# EAGLE schematic OBCv5.0 (EAGLE 9.6.2)

## Sheet 1 of 3
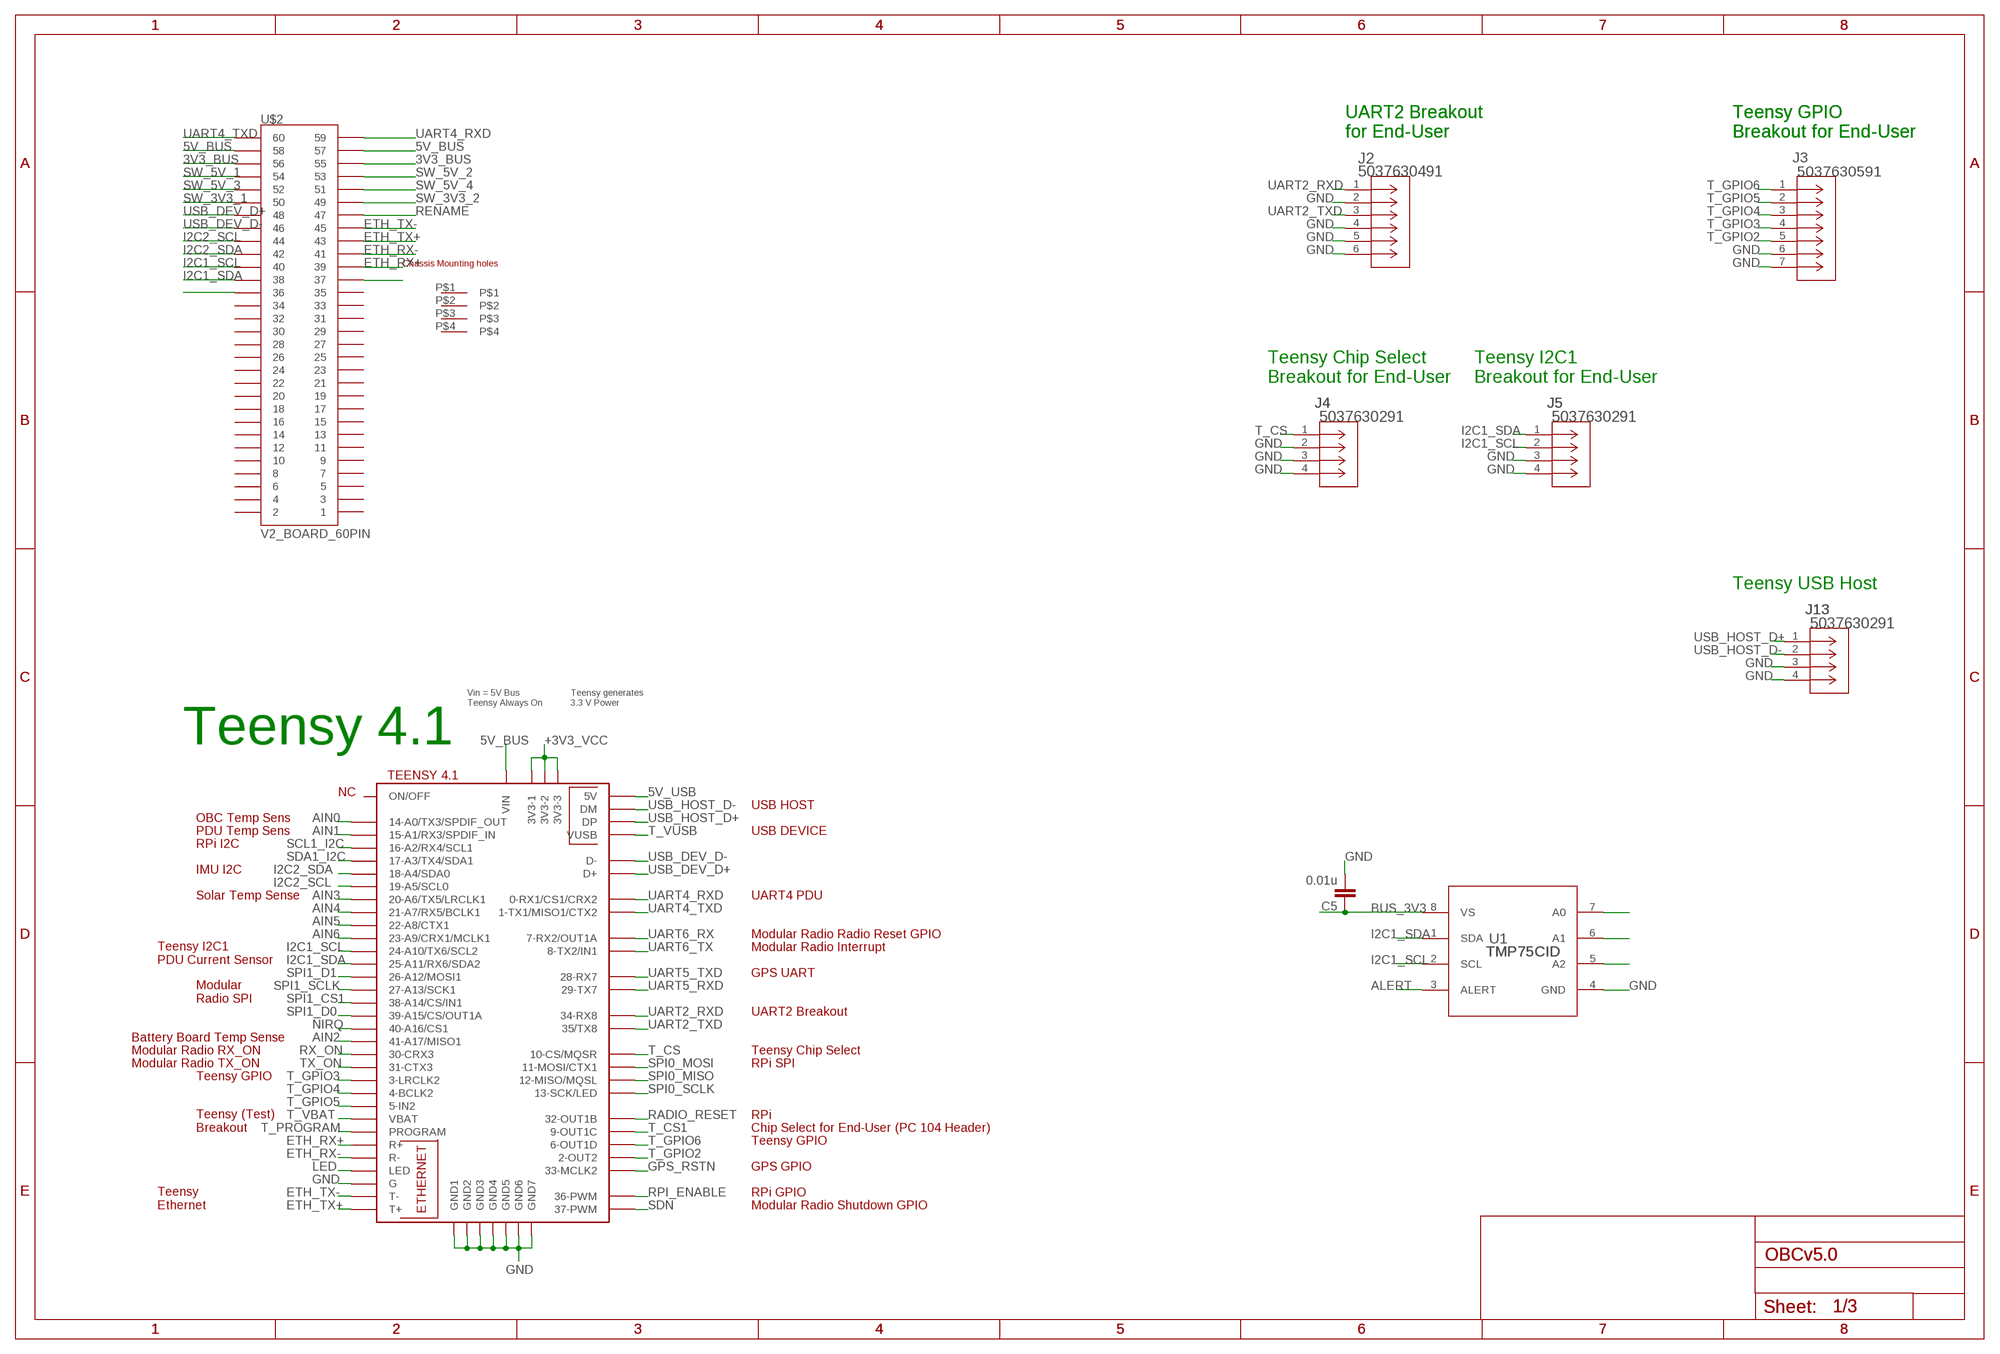
[diagram p0: schematic, sheet 1]

### Parts
C5  0.01u  CAP0805  [0805]
J2  5037630491  [CON_5037630491]
J3  5037630591  [CON_5037630591]
J4  5037630291  [CON_5037630291]
J5  5037630291  [CON_5037630291]
J13  5037630291  [CON_5037630291]
U1  TMP75CID  [D0008A_N]
U$1  TEENSY41TEENSY  [TEENSY41]
U$2  V2_BOARD_60PIN  [PC104_WCONN_BACKPLANE_HEADER]

### Nets
3V3_BUS: U$2.55 U$2.56
5V_BUS: U$1.VIN U$2.57 U$2.58 ; also sheet 2
5V_USB: U$1.+5V(5V)
+3V3_VCC: U$1.3V3-1 U$1.3V3-2 U$1.3V3-3 ; also sheet 3
AIN0: U$1.14-A0/TX3/SPDIF_OUT
AIN1: U$1.15-A1/RX3/SPDIF_IN
AIN2: U$1.41-A17/MISO1
AIN3: U$1.20-A6/TX5/LRCLK1
AIN4: U$1.21-A7/RX5/BCLK1
AIN5: U$1.22-A8/CTX1
AIN6: U$1.23-A9/CRX1/MCLK1
ALERT: U1.3(ALERT)
BUS_3V3: C5.1 U1.8(VS)
ETH_RX+: U$1.R+ U$2.39
ETH_RX-: U$1.R- U$2.41
ETH_TX+: U$1.T+ U$2.43
ETH_TX-: U$1.T- U$2.45
GND: C5.2 J2.2 J2.4 J2.5 J2.6 J3.6 J3.7 J4.2 J4.3 J4.4 J5.3 J5.4 J13.3 J13.4 U1.4(GND) U$1.G U$1.GND1 U$1.GND2 U$1.GND3 U$1.GND4 U$1.GND5 U$1.GND6 U$1.GND(GND7) ; also sheet 2,3
GPS_RSTN: U$1.33-MCLK2
I2C1_SCL: J5.2 U1.2(SCL) U$1.24-A10/TX6/SCL2 U$2.40
I2C1_SDA: J5.1 U1.1(SDA) U$1.25-A11/RX6/SDA2 U$2.38
I2C2_SCL: U$1.19-A5/SCL0 U$2.44 ; also sheet 3
I2C2_SDA: U$1.18-A4/SDA0 U$2.42 ; also sheet 3
LED: U$1.LED
N$11: U$2.37
N$12: U1.5(A2)
N$13: U1.6(A1)
N$15: U1.7(A0)
N$24: U$2.36
NIRQ: U$1.40-A16/CS1 ; also sheet 3
RADIO_RESET: U$1.32-OUT1B ; also sheet 3
RENAME: U$2.47
RPI_ENABLE: U$1.36-PWM ; also sheet 2
RX_ON: U$1.30-CRX3 ; also sheet 3
SCL1_I2C: U$1.16-A2/RX4/SCL1 ; also sheet 2
SDA1_I2C: U$1.17-A3/TX4/SDA1 ; also sheet 2
SDN: U$1.37-PWM ; also sheet 3
SPI0_MISO: U$1.12-MISO/MQSL ; also sheet 2
SPI0_MOSI: U$1.11-MOSI/CTX1 ; also sheet 2
SPI0_SCLK: U$1.13-SCK/LED ; also sheet 2
SPI1_CS1: U$1.38-A14/CS/IN1 ; also sheet 3
SPI1_D0: U$1.39-A15/CS/OUT1A ; also sheet 3
SPI1_D1: U$1.26-A12/MOSI1 ; also sheet 3
SPI1_SCLK: U$1.27-A13/SCK1 ; also sheet 3
SW_3V3_1: U$2.50
SW_3V3_2: U$2.49 ; also sheet 3
SW_5V_1: U$2.54
SW_5V_2: U$2.53
SW_5V_3: U$2.52
SW_5V_4: U$2.51
T_CS: J4.1 U$1.10-CS\MQSR(10-CS/MQSR)
T_CS1: U$1.9-OUT1C
T_GPIO2: J3.5 U$1.2-OUT2
T_GPIO3: J3.4 U$1.3-LRCLK2
T_GPIO4: J3.3 U$1.4-BCLK2
T_GPIO5: J3.2 U$1.5-IN2
T_GPIO6: J3.1 U$1.6-OUT1D
T_PROGRAM: U$1.PROGRAM
T_VBAT: U$1.VBAT
T_VUSB: U$1.VUSB
TX_ON: U$1.31-CTX3 ; also sheet 3
UART2_RXD: J2.1 U$1.34-RX8
UART2_TXD: J2.3 U$1.35-TX8(35/TX8)
UART4_RXD: U$1.0-RX1/CS1/CRX2 U$2.59
UART4_TXD: U$1.1-TX1/MISO1/CTX2 U$2.60
UART5_RXD: U$1.29-TX7
UART5_TXD: U$1.28-RX7
UART6_RX: U$1.7-RX2/OUT1A ; also sheet 2
UART6_TX: U$1.8-TX2/IN1 ; also sheet 2
USB_DEV_D+: U$1.D+ U$2.48
USB_DEV_D-: U$1.D- U$2.46
USB_HOST_D+: J13.1 U$1.DP
USB_HOST_D-: J13.2 U$1.DM
Unconnected: U$1.ON/OFF U$2.1 U$2.2 U$2.3 U$2.4 U$2.5 U$2.6 U$2.7 U$2.8 U$2.9 U$2.10 U$2.11 U$2.12 U$2.13 U$2.14 U$2.15 U$2.16 U$2.17 U$2.18 U$2.19 U$2.20 U$2.21 U$2.22 U$2.23 U$2.24 U$2.25 U$2.26 U$2.27 U$2.28 U$2.29 U$2.30 U$2.31 U$2.32 U$2.33 U$2.34 U$2.35 U$2.P$1 U$2.P$2 U$2.P$3 U$2.P$4

### Notes on the sheet
- UART2 Breakout
  for End-User
- UART2 Breakout
  for End-User
- Teensy GPIO
  Breakout for End-User
- Teensy GPIO
  Breakout for End-User
- Teensy Chip Select
  Breakout for End-User
- Teensy I2C1 
  Breakout for End-User
- Teensy USB Host
- Vin = 5V Bus 
  Teensy Always On
- Teensy generates 
  3.3 V Power
- Teensy 4.1
- NC
- USB HOST
- OBC Temp Sens
- PDU Temp Sens | USB DEVICE
- RPi I2C
- IMU I2C
- Solar Temp Sense | UART4 PDU
- Modular Radio Radio Reset GPIO
- Modular Radio Interrupt
- Teensy I2C1
  PDU Current Sensor
- GPS UART
- Modular 
  Radio SPI
- UART2 Breakout
- Battery Board Temp Sense
- Modular Radio RX_ON | Teensy Chip Select
- Modular Radio TX_ON | RPi SPI
- Teensy GPIO
- RPi
- Teensy (Test)
  Breakout
- Chip Select for End-User (PC 104 Header)
- Teensy GPIO
- GPS GPIO
- RPi GPIO
- Teensy 
  Ethernet
- Modular Radio Shutdown GPIO

## Sheet 2 of 3
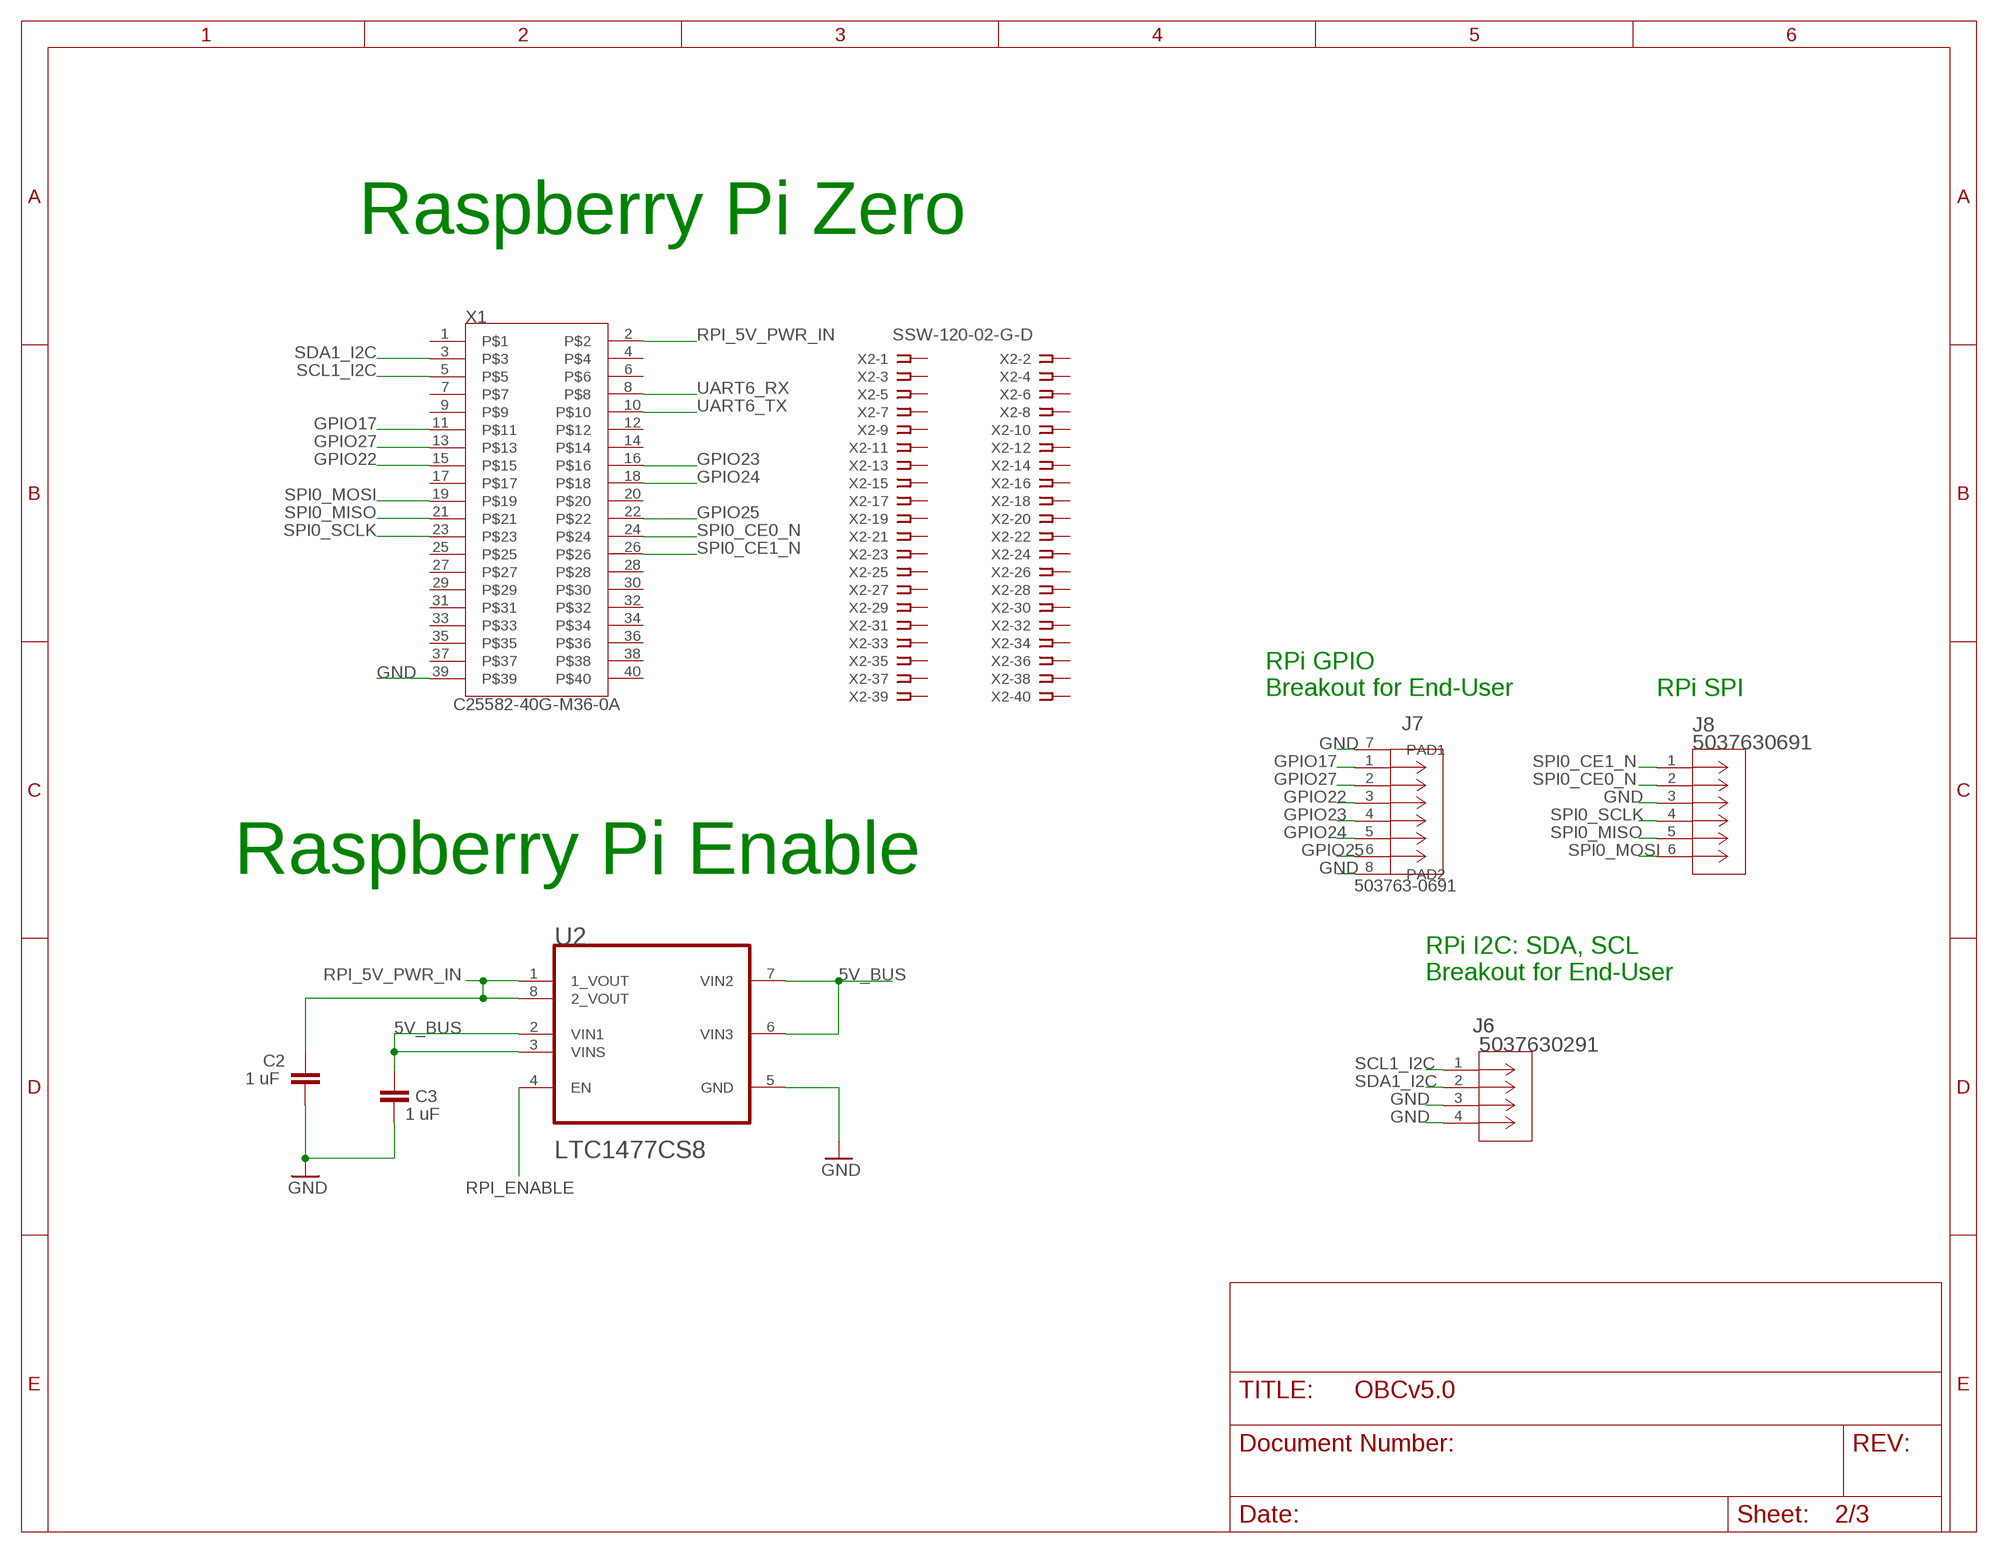
[diagram p1: schematic, sheet 2]

### Parts
C2  1 uF  CAP0805  [0805]
C3  1 uF  CAP0805  [0805]
J6  5037630291  [CON_5037630291]
J7  503763-0691  [CONN_503763-0691_MOL]
J8  5037630691  [CONN_503763-0691_MOL]
U2  LTC1477CS8LINEAR_TECHNOLOGY_LTC1477CS8_0_2  [LINEAR_TECHNOLOGY_LTC1477CS8_2]
X1  C25582-40G-M36-0A  [ADAFRUIT_C25582-40G-M36-0A_0]
X2  SSW-120-02-G-D  [SSW-120-02-G-D]

### Nets
5V_BUS: C3.1 U2.2(VIN1) U2.3(VINS) U2.6(VIN3) U2.7(VIN2) ; also sheet 1
GND: C2.2 C3.2 J6.3 J6.4 J7.7(PAD1) J7.8(PAD2) J8.3 U2.5(GND) X1.39 ; also sheet 1,3
GPIO17: J7.1 X1.11
GPIO22: J7.3 X1.15
GPIO23: J7.4 X1.16
GPIO24: J7.5 X1.18
GPIO25: J7.6 X1.22
GPIO27: J7.2 X1.13
RPI_5V_PWR_IN: C2.1 U2.1(1_VOUT) U2.8(2_VOUT) X1.2
RPI_ENABLE: U2.4(EN) ; also sheet 1
SCL1_I2C: J6.1 X1.5 ; also sheet 1
SDA1_I2C: J6.2 X1.3 ; also sheet 1
SPI0_CE0_N: J8.2 X1.24
SPI0_CE1_N: J8.1 X1.26
SPI0_MISO: J8.5 X1.21 ; also sheet 1
SPI0_MOSI: J8.6 X1.19 ; also sheet 1
SPI0_SCLK: J8.4 X1.23 ; also sheet 1
UART6_RX: X1.8 ; also sheet 1
UART6_TX: X1.10 ; also sheet 1
Unconnected: X1.1 X1.4 X1.6 X1.7 X1.9 X1.12 X1.14 X1.17 X1.20 X1.25 X1.27 X1.28 X1.29 X1.30 X1.31 X1.32 X1.33 X1.34 X1.35 X1.36 X1.37 X1.38 X1.40 X2.1 X2.2 X2.3 X2.4 X2.5 X2.6 X2.7 X2.8 X2.9 X2.10 X2.11 X2.12 X2.13 X2.14 X2.15 X2.16 X2.17 X2.18 X2.19 X2.20 X2.21 X2.22 X2.23 X2.24 X2.25 X2.26 X2.27 X2.28 X2.29 X2.30 X2.31 X2.32 X2.33 X2.34 X2.35 X2.36 X2.37 X2.38 X2.39 X2.40

### Notes on the sheet
- Raspberry Pi Zero
- RPi GPIO
  Breakout for End-User
- RPi SPI
- Raspberry Pi Enable
- RPi I2C: SDA, SCL 
  Breakout for End-User

## Sheet 3 of 3
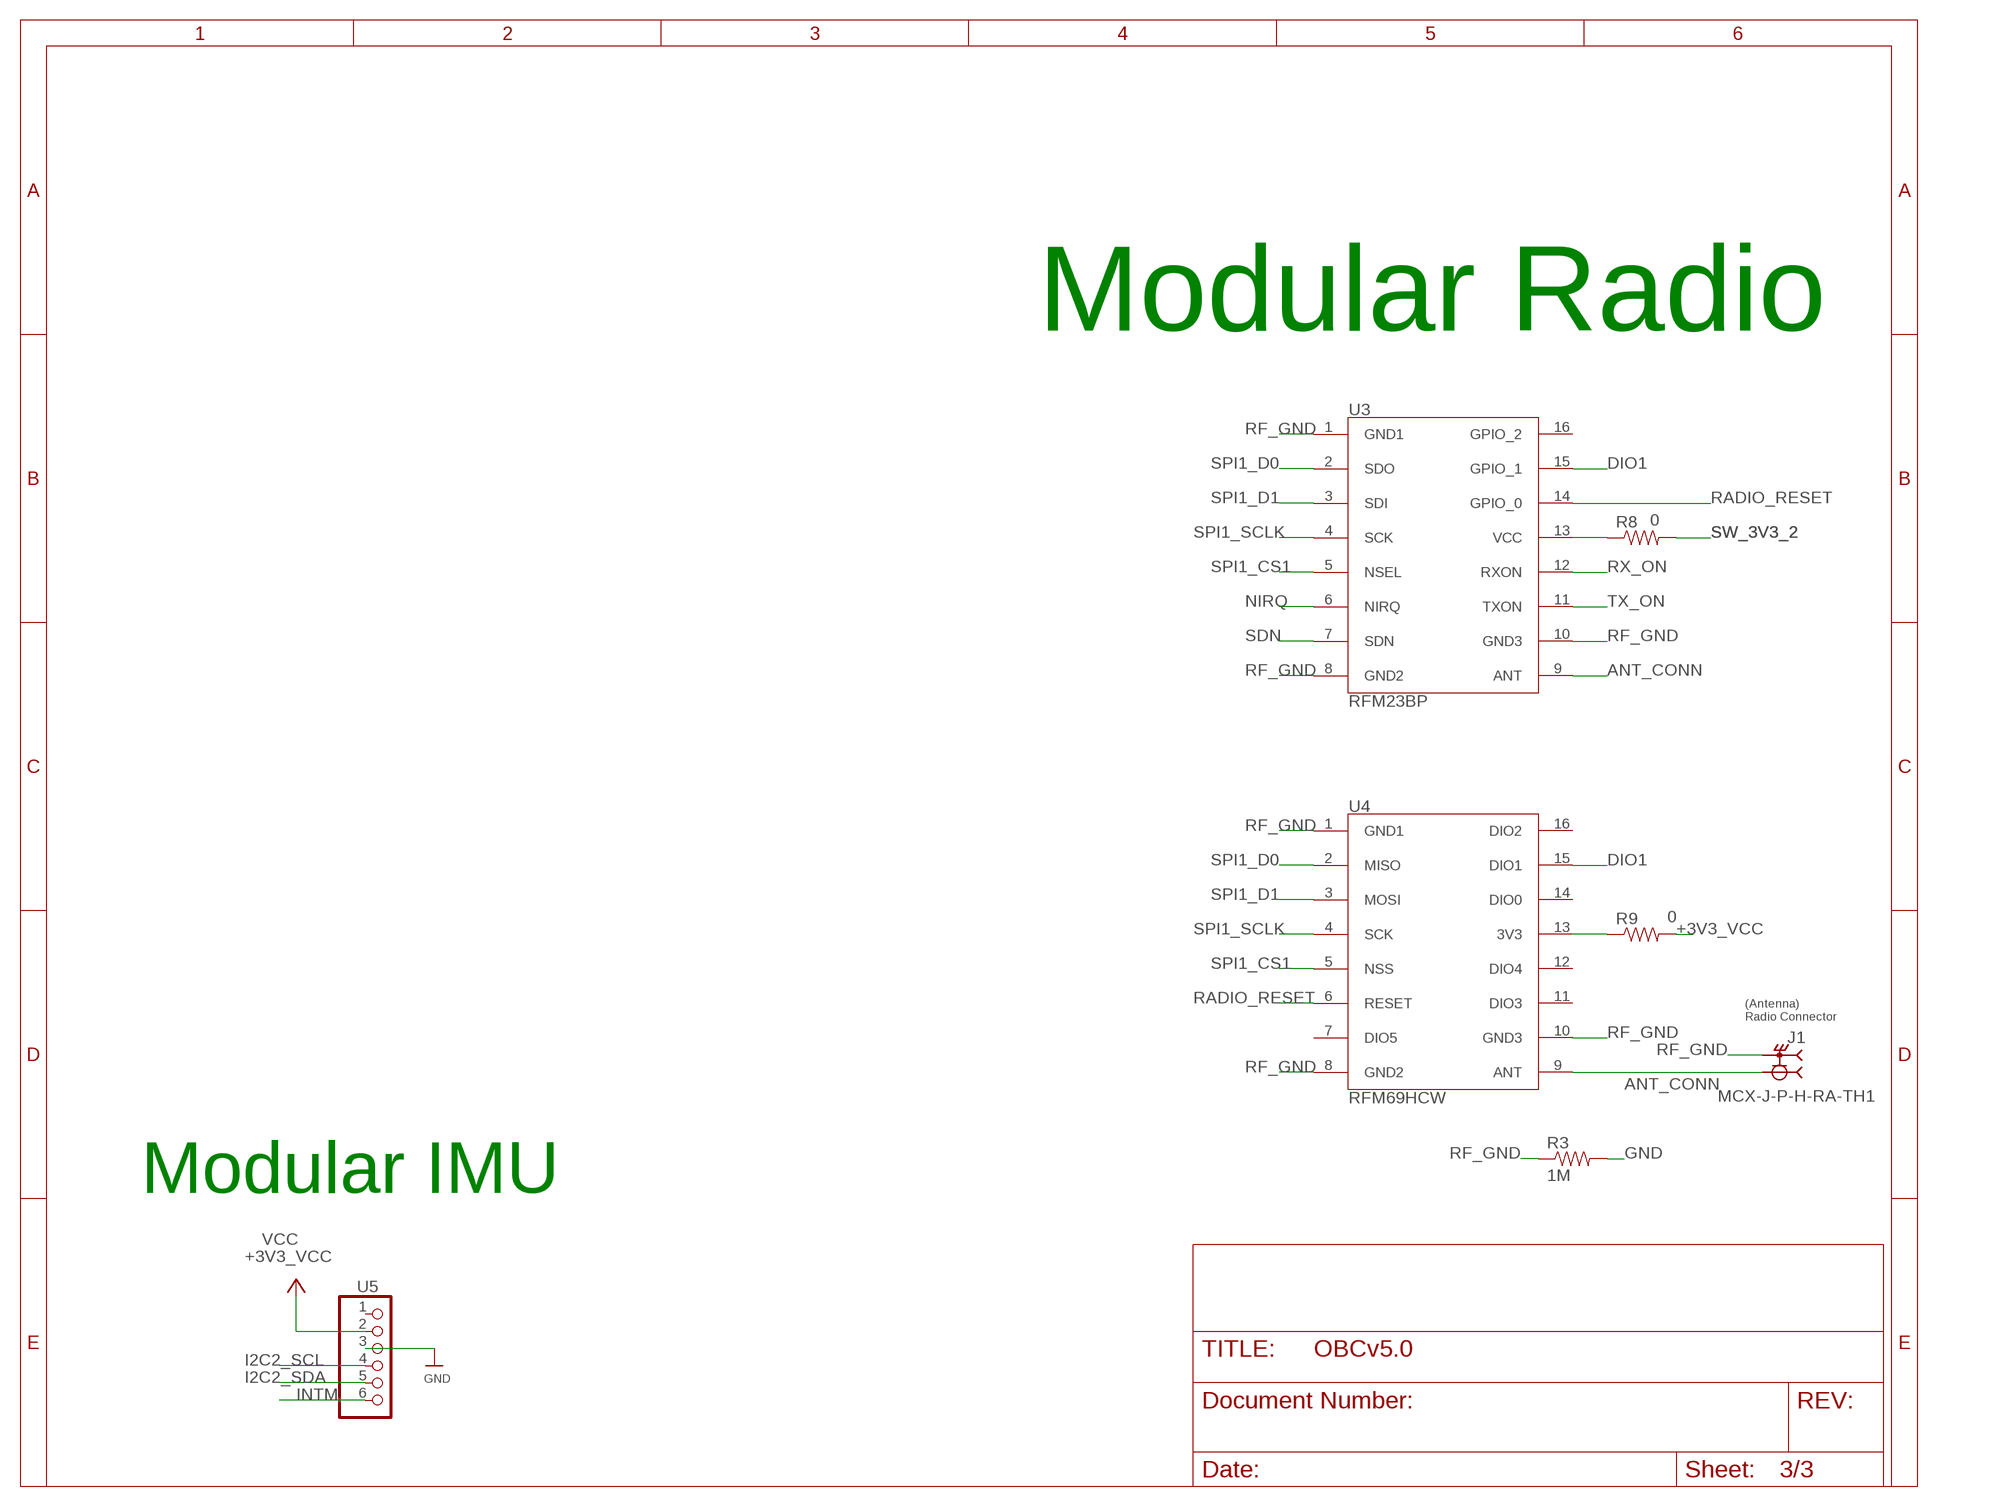
[diagram p2: schematic, sheet 3]

### Parts
J1  MCX-J-P-H-RA-TH1  [SAMTEC_MCX-J-P-H-RA-TH1]
R3  1M  RESISTOR0805-RES  [0805]
R8  0  RESISTOR2512  [R2512]
R9  0  RESISTOR2512  [R2512]
U3  RFM23BP  [RFM23BP]
U4  RFM69HCW  [RFM69HCW]
U5  HEADER-1X670MIL  [1X06_ROUND_70]

### Nets
+3V3_VCC: R9.2 U5.2 ; supply symbol labelled VCC ; also sheet 1
ANT_CONN: J1.1 U3.9(ANT) U4.9(ANT)
DIO1: U3.15(GPIO_1) U4.15(DIO1)
GND: R3.2 U5.3 ; also sheet 1,2
I2C2_SCL: U5.4 ; also sheet 1
I2C2_SDA: U5.5 ; also sheet 1
INTM: U5.6
N$9: R8.1 U3.13(VCC)
N$10: R9.1 U4.13(3V3)
NIRQ: U3.6(NIRQ) ; also sheet 1
RADIO_RESET: U3.14(GPIO_0) U4.6(RESET) ; also sheet 1
RF_GND: J1.S1 J1.S2 J1.S3 J1.S4 R3.1 U3.1(GND1) U3.8(GND2) U3.10(GND3) U4.1(GND1) U4.8(GND2) U4.10(GND3)
RX_ON: U3.12(RXON) ; also sheet 1
SDN: U3.7(SDN) ; also sheet 1
SPI1_CS1: U3.5(NSEL) U4.5(NSS) ; also sheet 1
SPI1_D0: U3.2(SDO) U4.2(MISO) ; also sheet 1
SPI1_D1: U3.3(SDI) U4.3(MOSI) ; also sheet 1
SPI1_SCLK: U3.4(SCK) U4.4(SCK) ; also sheet 1
SW_3V3_2: R8.2 ; also sheet 1
TX_ON: U3.11(TXON) ; also sheet 1
Unconnected: U3.16(GPIO_2) U4.7(DIO5) U4.11(DIO3) U4.12(DIO4) U4.14(DIO0) U4.16(DIO2) U5.1

### Notes on the sheet
- Modular Radio
- (Antenna)
  Radio Connector
- Modular IMU

## Library data of the parts
C2 C3 = HSFL_Main_Library:CAP: Capacitor Standard 0603 ceramic capacitor, and 0.1" leaded capacitor.
C5 = HSFL_Main_Library (1):CAP: Capacitor Standard 0603 ceramic capacitor, and 0.1" leaded capacitor.
J1 = OBCv4:MCX-J-P-H-RA-TH1: 50 Ohm MCX Jack or Plug, Through-hole; DESCRIPTION: MCX Connector Jack, Female Socket 50Ohm Through Hole, Right Angle Solder; DIGI-KEY_PART_NUMBER: SAM10607-ND; MF: Samtec; MP: MCX-J-P-H-RA-TH1; PACKAGE: None; PURCHASE-URL: https://pricing.snapeda.com/search/part/MCX-J-P-H-RA-TH1/?ref=eda
J2 = OBCv4:5037630491; BUILT_BY: Molex_Team; COPYRIGHT: Copyright (C) 2018 Accelerated Designs. All rights reserved; MANUFACTURER_PART_NUMBER: 5037630491; SOURCELIBRARY: Add_to_database_2021-03-17; VENDOR: Molex Connector Corporation
J3 = OBCv4:5037630591; COPYRIGHT: Copyright (C) 2021 Ultra Librarian. All rights reserved.; MANUFACTURER_PART_NUMBER: 5037630591; MFR_NAME: Molex Connector Corporation
J4-J6 J13 = OBCv4:5037630291; BUILT_BY: Molex_Team; COPYRIGHT: Copyright (C) 2018 Accelerated Designs. All rights reserved; MANUFACTURER_PART_NUMBER: 5037630291; SOURCELIBRARY: Add_to_database_2021-03-17; VENDOR: Molex Connector Corporation
J7 = Improved Molex 503763-0691:503763-0691; BUILT_BY: EMA_Cory; COPYRIGHT: Copyright (C) 2018 Accelerated Designs. All rights reserved; DATASHEET: https://www.digikey.com/products/en?keywords=503763-0691; MANUFACTURER_PART_NUMBER: 503763-0691; SOURCELIBRARY: Molex_2020-01-22; VENDOR: Molex Connector Corporation
J8 = OBCv4:5037630691; BUILT_BY: EMA_Cory; COPYRIGHT: Copyright (C) 2018 Accelerated Designs. All rights reserved; DATASHEET: https://www.digikey.com/products/en?keywords=503763-0691; MANUFACTURER_PART_NUMBER: 503763-0691; SOURCELIBRARY: Molex_2020-01-22; VENDOR: Molex Connector Corporation
R3 R8 R9 = HSFL_Main_Library:RESISTOR: Resistor Basic schematic elements and footprints for 0603, 1206, and PTH resistors.
U1 = TMP75CID:TMP75CID; COPYRIGHT: Copyright (C) 2023 Ultra Librarian. All rights reserved.; MANUFACTURER_PART_NUMBER: TMP75CID; MFR_NAME: Texas Instruments; REFDES: RefDes; TYPE: TYPE
U2 = Artemis:LTC1477CS8: LT-LTC1477-S8-8; CIIVA_IDS: 1432281; COMPONENT_LINK_1_DESCRIPTION: Manufacturer URL; COMPONENT_LINK_1_URL: http://www.linear.com/; COMPONENT_LINK_3_DESCRIPTION: Package Specification; COMPONENT_LINK_3_URL: http://cds.linear.com/docs/en/packaging/05081610_G_SO8.pdf; DATASHEET: http://cds.linear.com/docs/en/datasheet/lt1477.pdf; FOOTPRINT_VARIANT_NAME_0: Level C; FOOTPRINT_VARIANT_NAME_1: Level B; FOOTPRINT_VARIANT_NAME_2: Level A; IMPORTED: yes; IMPORTED_FROM: vault; IMPORT_TS: 1521843574; MF: Linear Technology; MOUNTING_TECHNOLOGY: Surface Mount; MPN: LTC1477CS8; PACKAGE: S8-8; PACKAGE_DESCRIPTION: 8-Pin Plastic Small Outline (Narrow .150 Inch), Body 4.9 x 3.9 mm, Pitch 1.27 mm; PACKAGE_VERSION: Rev. G, 03/2012; PREFIX: U; RELEASE_DATE: 1377817843; ROHS: No; VAULT_GUID: 635B2D7C-EC07-409E-A57F-666E02CD64AC; VAULT_REVISION: 6B8B57C2-2CB3-4970-A31A-1EB58B636423
U3 = RFM RADIOS:RFM23BP
U4 = RFM RADIOS:RFM69HCW
U5 = microbuilder:HEADER-1X6: PIN HEADER
U$1 = OBCv4:TEENSY41
U$2 = Artemis v2 board:V2_BOARD_60PIN
X1 = Adafruit - C25582-40G-M36-0A:C25582-40G-M36-0A
X2 = con-samtec-edited:SSW-120-02-G: THROUGH-HOLE .025" SQ POST SOCKET Source: Samtec SSW.pdf; MF: Samtec Inc.; MPN: SSW-120-02-G-D; OC_FARNELL: unknown; OC_NEWARK: 11P9639

## Net classes
1 highpower: width 0.406 mm, drill 0.483 mm
2 lowpower: width 0.305 mm, drill 0.483 mm